# Altium project RF-learn-command-1relay.PrjPcb
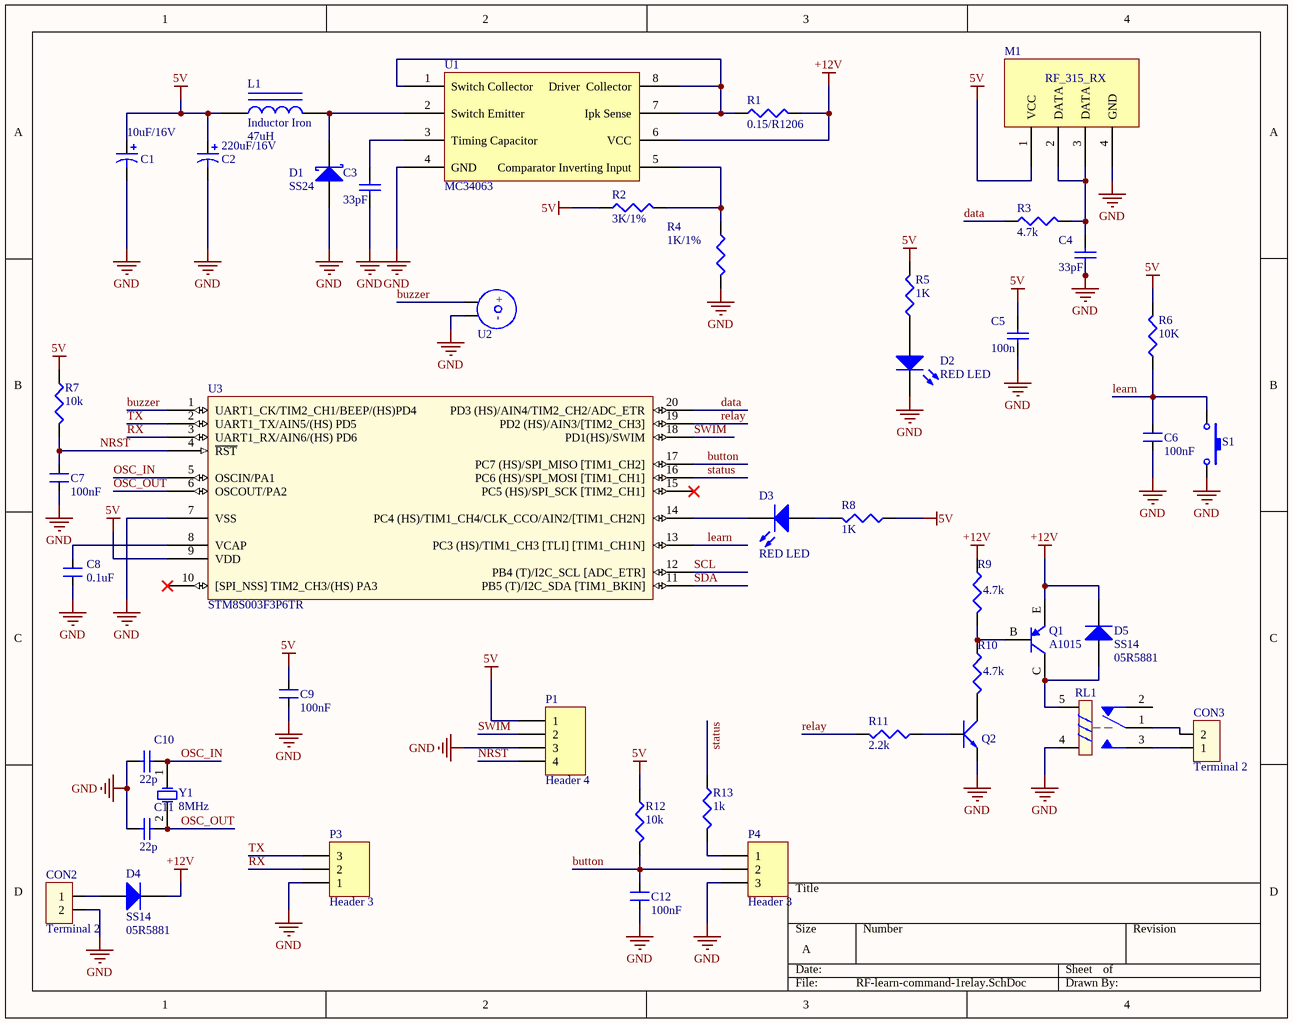
[diagram p0: RF-learn-command-1relay.SchDoc]
1 sheet, 45 parts. Net scope: global (net labels, ports and power ports of the same name join across sheets).
Board file: RF-learn-command-1relay.PcbDoc

## Sheet RF-learn-command-1relay.SchDoc: RF-learn-command-1relay
size A; ApprovedBy: nhantt; CheckedBy: nhantt; Author: nhantt; CompanyName: TTN; DrawnBy: nhantt; Engineer: nhantt; Revision: nhantt; SheetNumber: 1; SheetTotal: 1; DocumentName: RF-learning-command-1Relay; ProjectName: RF-lear-command-1relay

### Parts
C1  10uF/16V  [C1206]
C2  220uF/16V  [CAPACITOR SIZE_D(D6.6)]
C3  33pF  [CM 0805]
C4  33pF  [CM 0805]
C5  100n  [CM 0805]
C6  100nF  [CM 0805]
C7  100nF  [CM 0805]
C8  0.1uF  [CM 0805]
C9  100nF  [CM 0805]
C10  22p  [CM 0805]
C11  22p  [CM 0805]
C12  100nF  [CM 0805]
CON2  Terminal 2  [Terminal 2 5.08]
CON3  Terminal 2  [domino-2pin-7.62]
D1  SS24  [DO-214AA]
D2  RED LED  [LED3mm-R]
D3  RED LED  [LED3mm-G]
D4  SS14  Supplier Part Number 1: 05R5881  [DO-214AC (SMA)]
D5  SS14  Supplier Part Number 1: 05R5881  [DO-214AC (SMA)]
L1  Inductor Iron  value 47uH  [4848]
M1  RF_315_RX  [Module-RF-RX]
P1  Header 4  [HDR1X4]
P3  Header 3  [HDR1X3]
P4  Header 3  [HEADER_3_W]
Q1  A1015  [SC-43-BCE]
Q2  C1815  [2SC1815]  (value not drawn)
R1  0.15/R1206  [R1206]
R2  3K/1%  [R0805]
R3  4.7k  [R0805]
R4  1K/1%  [R0805]
R5  1K  [R0805]
R6  10K  [R0805]
R7  10k  [R0805]
R8  1K  [R0805]
R9  4.7k  [R0805]
R10  4.7k  [R0805]
R11  2.2k  [R0805]
R12  10k  [R0805]
R13  1k  [R0805]
RL1  Relay SPDT, 10A, 12V  [RL-SLA-24/12VDC-SL-C]  (value not drawn)
S1  SW-SMD  [Button Tactile Switch]  (value not drawn)
U1  MC34063  [SO8-150mil]
U2  Buzzer  [Buzzer]  (value not drawn)
U3  STM8S003F3P6TR  [SSOP-20]
Y1  8MHz  [HC49/US-SMD]

### Nets
5V: C1.1 C2.1 C5.1 C9.2 L1.1 M1.1(VCC) P1.1 R2.1 R5.2 R6.2 R7.1 R8.1 R12.1 U3.9(VDD)
+12V: D4.2(K) D5.2(K) Q1.E R1.2 R9.1 U1.6(VCC)
GND: C1.2 C2.2 C3.2 C4.2 C5.2 C6.1 C7.1 C8.1 C9.1 C10.1 C11.1 C12.1 CON2.2 D1.1(A) D2.2(K) M1.4(GND) P1.3 P3.1 P4.3 Q2.2(E) R4.2 RL1.4 S1.2 U1.4(GND) U2.2 U3.7(VSS)
button: C12.2 P4.2 R12.2 U3.17(PC7_(HS)/SPI_MISO_[TIM1_CH2])
buzzer: U2.1 U3.1(UART1_CK/TIM2_CH1/BEEP/(HS)PD4)
data: R3.1 U3.20(PD3_(HS)/AIN4/TIM2_CH2/ADC_ETR)
learn: C6.2 R6.1 S1.1 U3.13(PC3_(HS)/TIM1_CH3_[TLI]_[TIM1_CH1N])
NRST: C7.2 P1.4 R7.2 U3.4(~{RST})
OSC_IN: C10.2 U3.5(OSCIN/PA1) Y1.1(OSC1)
OSC_OUT: C11.2 U3.6(OSCOUT/PA2) Y1.2(OSC2)
relay: R11.2 U3.19(PD2_(HS)/AIN3/[TIM2_CH3])
RX: P3.2 U3.3(UART1_RX/AIN6/(HS)_PD6)
SCL: U3.12(PB4_(T)/I2C_SCL_[ADC_ETR])
SDA: U3.11(PB5_(T)/I2C_SDA_[TIM1_BKIN])
status: R13.1 U3.16(PC6_(HS)/SPI_MOSI_[TIM1_CH1])
SWIM: P1.2 U3.18(PD1(HS)/SWIM)
TX: P3.3 U3.2(UART1_TX/AIN5/(HS)_PD5)
NetC3_1: C3.1 U1.3(Timing_Capacitor)
NetC4_1: C4.1 M1.2(DATA) M1.3(DATA) R3.2
NetC8_2: C8.2 U3.8(VCAP)
NetCON2_1: CON2.1 D4.1(A)
NetCON3_1: CON3.1 RL1.3
NetCON3_2: CON3.2 RL1.1
NetD1_2: D1.2(K) L1.2 U1.2(Switch_Emitter)
NetD2_1: D2.1(A) R5.1
NetD3_1: D3.1(A) R8.2
NetD3_2: D3.2(K) U3.14(PC4_(HS)/TIM1_CH4/CLK_CCO/AIN2/[TIM1_CH2N])
NetD5_1: D5.1(A) Q1.C RL1.5
NetP4_1: P4.1 R13.2
NetQ1_B: Q1.B R9.2 R10.1
NetQ2_1: Q2.1(B) R11.1
NetQ2_3: Q2.3(C) R10.2
NetR1_1: R1.1 U1.1(Switch_Collector) U1.7(Ipk_Sense) U1.8(Driver__Collector)
NetR2_2: R2.2 R4.1 U1.5(Comparator_Inverting_Input)

Not connected (* = marked no-connect by the designer): RL1 2; U3 10([SPI_NSS]_TIM2_CH3/(HS)_PA3)* 15(PC5_(HS)/SPI_SCK_[TIM2_CH1])*

### Notes on the sheet
- (in symbol Buzzer) +; -

### Library data of the parts
C1 C2 = Cap Pol3: Polarized Capacitor (Surface Mount); Published: 8-Jun-2000; LatestRevisionDate: 29-May-2009; LatestRevisionNote: IPC-7351 Footprint Added.; PackageReference: C0805; Publisher: Altium Limited; PackageDescription: Chip Capacitor; Supplier 1: Digi-Key
C3-C5 = Cap Semi: Capacitor 100n 16V 0603; Published: 8-Jun-2000; LatestRevisionDate: 29-May-2009; LatestRevisionNote: IPC-7351 Footprint Added.; PackageReference: C1206; Publisher: Altium Limited; PackageDescription: Chip Capacitor
C6-C9 C12 = CM Ceramic: SMD Ceramic  Capacitor; Manufacturer No: C0805KRX7R9BB104; Manufacturer: Yageo; Voltage: 50V; Tolerance: 10%; Specification: ="Capacitance"+" "+"Voltage"+" " +"Tolerance"
  C6 C7 C9 C12: Capacitance: 100nF
  C8: Capacitance: 0.1uF
C10 C11 = Cap Semi: Capacitor (Semiconductor SIM Model); Published: 8-Jun-2000; LatestRevisionDate: 29-May-2009; LatestRevisionNote: IPC-7351 Footprint Added.; PackageReference: C1206; Publisher: Altium Limited; PackageDescription: Chip Capacitor
CON2 CON3 = Terminal 2: Value: Connector 2
D1 = D Schottky: Schottky Diode; Published: 8-Jun-2000; LatestRevisionDate: 17-Jul-2002; LatestRevisionNote: Re-released for DXP Platform.; PackageReference: SMB; Publisher: Altium Limited; Code_JEDEC: DO-214-AA; Supplier 1: Newark; Supplier Part Number 1: 05R5881
D2 D3 = LED2: LED SUPR RED CLR 0805 RT ANG SMD; Manufacturer: Lite-On Inc; Manufacturer Part Number: LTST-S220KRKT; Value: LED RED; Published: 8-Jun-2000; LatestRevisionDate: 17-Jul-2002; LatestRevisionNote: Re-released for DXP Platform.; PackageVersion: Feb-2002; PackageReference: 3.2X1.6X1.1; Publisher: Altium Limited; Digi-Key Part Number: 160-1469-2-ND; Unit Price: 0.03780
D4 D5 = Diode: DIODE GEN PURPOSE 1000V 1A SMA; Manufacturer Part Number: CGRA4007-G; Manufacturer: Comchip Technology; Value: 1N4007; Published: 8-Jun-2000; LatestRevisionDate: 17-Jul-2002; LatestRevisionNote: Re-released for DXP Platform.; PackageVersion: Sep-1996; PackageReference: DO-214-AA; Publisher: Altium Limited; Code_JEDEC: DO-214-AB; Digi-Key Part Number: 641-1018-1-ND; Unit Price: 0.05130; Supplier 1: Newark
L1 = Inductor Iron: Magnetic-Core Inductor; Published: 24-Mar-1999; LatestRevisionDate: 17-Jul-2002; LatestRevisionNote: Re-released for DXP Platform.; PackageReference: AXIAL-0.9; Publisher: Altium Limited
M1 = ModuleRF-RX
P1 = Header 4: Header, 4-Pin; LatestRevisionDate: 17-Jul-2002; LatestRevisionNote: Re-released for DXP Platform.; Publisher: Altium Limited
P3 P4 = Header 3: Header, 3-Pin; LatestRevisionDate: 17-Jul-2002; LatestRevisionNote: Re-released for DXP Platform.; Publisher: Altium Limited
Q1 = PNP Transistor
Q2 = C1815: NPN SMD Transistor; Manufacturer No: 2SC1815-HF; Manufacturer: Toshiba; Vendor: BL Galaxy Electrical; Vendor_Vietnam: TME; Value: C1815; Specification: C1815
R1 R2 R4-R6 R8 = Res3: Resistor 10k 0603; Published: 8-Jun-2000; LatestRevisionDate: 29-May-2009; LatestRevisionNote: IPC-7351 Footprint Added.; PackageReference: J1-0603; Publisher: Altium Limited; PackageDescription: Chip Resistor
R3 R9-R11 R13 = Res3: Resistor; Manufacturer: Vishay / Draloric; Manufacturer Part Number: RCV0805301KFKEA; Value: 10k; Power Rating: 125 mW (1/8 W); Resistance: 301 kOhms; Temperature Coefficient: 100 PPM / K; Tolerance: 1 %; Voltage Rating: 400 V; Case Height: 0.45 mm; Case Length: 2 mm; Case Width: 1.25 mm; Product Status: New Product; Published: 8-Jun-2000; LatestRevisionDate: 29-May-2009; LatestRevisionNote: IPC-7351 Footprint Added.; PackageReference: J1-0603; Publisher: Altium Limited; PackageDescription: Chip Resistor; Supplier 1: Mouser; Supplier Part Number 1: 71-RCV0805301KFKEA; RoHS: RoHS Compliant; Category: Thick Film Resistors - SMD; Stock 1: 5000; Pricing 1: 1=0.330, 50=0.177, 100=0.102, 500=0.069, 1000=0.054, 5000=0.051, 10000=0.048, 15000=0.040, 25000=0.033 (USD); Operating Temperature Range: - 55 C to + 155 C; Package / Case: 0805 (2012 metric); Packaging: Reel; Product: Thick Film Resistors SMD; Series: RCV; Case Code - in: 0805; Case Code - mm: 2012; Product Category: 0805 Thick Film Chip Resistors; RoHS - Mouser: Y; Minimum Order Quantity: 1; Reeling: True; ComponentLink1URL: http://www.vishay.com/docs/20054/rcve3.pdf; ComponentLink1Description: http://www.vishay.com/docs/20054/rcve3.pdf
R7 R12 = Res3: Resistor; Manufacturer: Vishay / Draloric; Manufacturer Part Number: RCV0805301KFKEA; Power Rating: 125 mW (1/8 W); Resistance: 301 kOhms; Temperature Coefficient: 100 PPM / K; Tolerance: 1 %; Voltage Rating: 400 V; Case Height: 0.45 mm; Case Length: 2 mm; Case Width: 1.25 mm; Product Status: New Product; Published: 8-Jun-2000; LatestRevisionDate: 29-May-2009; LatestRevisionNote: IPC-7351 Footprint Added.; PackageReference: J1-0603; Publisher: Altium Limited; PackageDescription: Chip Resistor; Value: 10k; Supplier 1: Mouser; Supplier Part Number 1: 71-RCV0805301KFKEA; RoHS: RoHS Compliant; Category: Thick Film Resistors - SMD; Stock 1: 5000; Pricing 1: 1=0.330, 50=0.177, 100=0.102, 500=0.069, 1000=0.054, 5000=0.051, 10000=0.048, 15000=0.040, 25000=0.033 (USD); Operating Temperature Range: - 55 C to + 155 C; Package / Case: 0805 (2012 metric); Packaging: Reel; Product: Thick Film Resistors SMD; Series: RCV; Case Code - in: 0805; Case Code - mm: 2012; Product Category: 0805 Thick Film Chip Resistors; RoHS - Mouser: Y; Minimum Order Quantity: 1; Reeling: True; ComponentLink1URL: http://www.vishay.com/docs/20054/rcve3.pdf; ComponentLink1Description: http://www.vishay.com/docs/20054/rcve3.pdf
RL1 = Relay 1: Relay SPDT,10A - 12VDC 5 Pin; Value: Relay SPDT, 10A, 12V
S1 = SW-SMD: Switch; Published: 24-Mar-1999; LatestRevisionDate: 17-Jul-2002; LatestRevisionNote: Re-released for DXP Platform.; PackageReference: SPST-2; Publisher: Altium Limited
U3 = STM8S003F3: MCU; Manufacturer: STMicroelectronics; Program Memory Type: Flash; A/D Bit Size: 10 bit; A/D Channels Available: 5; Data RAM Size: 1 KB; Data ROM Size: 128 B; Interface Type: I2C, SPI, UART; Program Memory Size: 8 KB; Core: STM8; Data Bus Width: 8 bit; Maximum Clock Frequency: 16 MHz; Number of Timers: 3; On-Chip ADC: Yes; On-Chip DAC: No; Operating Supply Voltage: 2.95 V to 5.5 V; Supply Voltage - Max: 5.5 V; Supply Voltage - Min: 2.95 V; Product Status: New Product; Supplier 1: Mouser; Supplier Part Number 1: 511-STM8S003F3P6TR; Manufacturer Part Number: STM8S003F3P6TR; RoHS: RoHS Compliant; Category: 8-bit Microcontrollers - MCU; Stock 1: 2832; Pricing 1: 1=0.910, 10=0.703, 100=0.559, 500=0.510, 1000=0.390, 2500=0.346, 10000=0.332, 25000=0.322 (USD); Package / Case: TSSOP-20; Packaging: Reel; Mounting Style: SMD/SMT; Maximum Operating Temperature: + 85 C; Minimum Operating Temperature: - 40 C; RoHS - Mouser: Y; Minimum Order Quantity: 1; Reeling: True; ComponentLink1URL: http://www.st.com/web/catalog/mmc/FM141/SC1244/SS1010/LN2/PF251792?referrer=70032480; ComponentLink1Description: http://www.st.com/web/catalog/mmc/FM141/SC1244/SS1010/LN2/PF251792?referrer=70032480; Supplier 2: Digi-Key
Y1 = XTAL: Crystal Oscillator; Published: 8-Jun-2000; LatestRevisionDate: 17-Jul-2002; LatestRevisionNote: Re-released for DXP Platform.; PackageReference: R38; Publisher: Altium Limited; Supplier 1: Newark; Supplier Part Number 1: 90B5422